# EAGLE design zx01io (EAGLE 4.08)
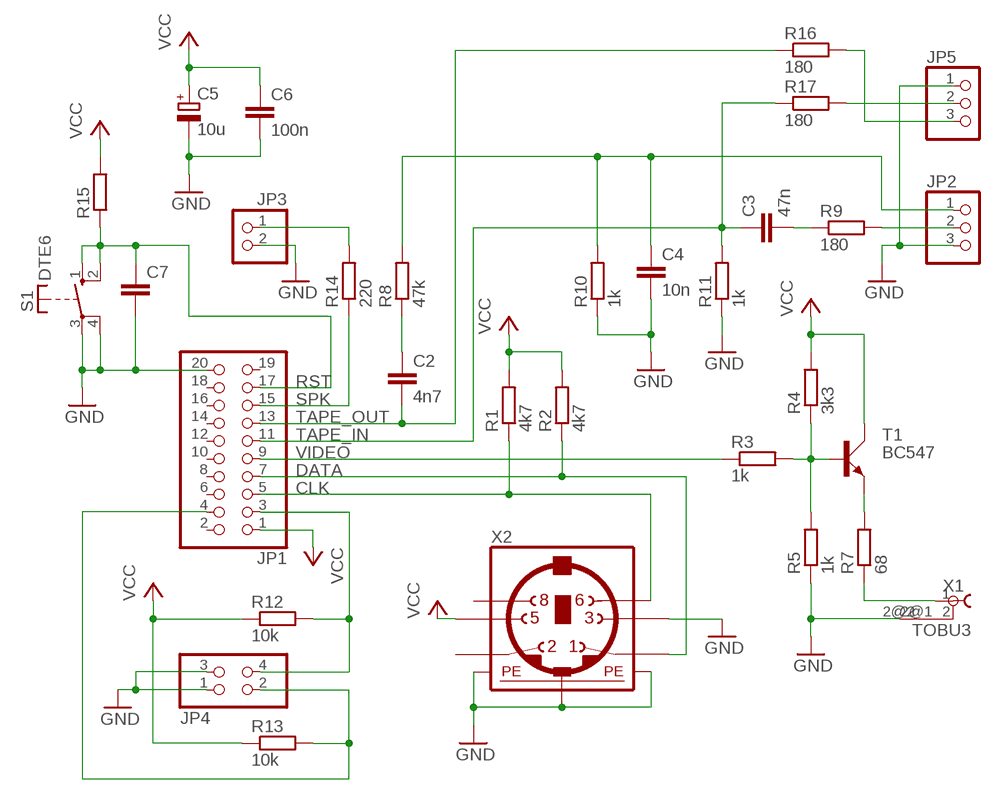
[diagram p0: schematic, sheet 1]

## Parts
C2  4n7  C-EU050-025X075  [C050-025X075]
C3  47n  C-EU050-025X075  [C050-025X075]
C4  10n  C-EU050-025X075  [C050-025X075]
C5  10u  CPOL-EUE5-6  [E5-6]
C6  100n  C-EU050-030X075  [C050-030X075]
C7  C-EU050-025X075  [C050-025X075]
JP1  PINHD-2X10  [2X10]
JP2  PINHD-1X3  [1X03]
JP3  PINHD-1X2  [1X02]
JP4  PINHD-2X2  [2X02]
JP5  PINHD-1X3  [1X03]
R1  4k7  R-EU_0207/5V  [0207/5V]
R2  4k7  R-EU_0207/5V  [0207/5V]
R3  1k  R-EU_0207/5V  [0207/5V]
R4  3k3  R-EU_0207/5V  [0207/5V]
R5  1k  R-EU_0207/5V  [0207/5V]
R7  68  R-EU_0207/5V  [0207/5V]
R8  47k  R-EU_0207/5V  [0207/5V]
R9  180  R-EU_0207/5V  [0207/5V]
R10  1k  R-EU_0207/5V  [0207/5V]
R11  1k  R-EU_0207/5V  [0207/5V]
R12  10k  R-EU_0207/5V  [0207/5V]
R13  10k  R-EU_0207/5V  [0207/5V]
R14  220  R-EU_0207/5V  [0207/5V]
R15  R-EU_0207/5V  [0207/5V]
R16  180  R-EU_0207/5V  [0207/5V]
R17  180  R-EU_0207/5V  [0207/5V]
S1  DTE6  [DTE6]
T1  BC547  [SOT54A]
X1  TOBU3  [TOBU3]
X2  MINI_DIN_6  [M_DIN6]

## Nets
CLK: JP1.5 R1.1 X2.6
DATA: JP1.7 R2.1 X2.1
GND: C4.2 C5.- C6.2 C7.2 JP1.20 JP2.3 JP3.2 JP4.1 JP4.3 JP5.1 R5.1 R10.1 R11.1 S1.3(P) S1.4(P) X1.2@2 X2.3 X2.SH1(PE1) X2.SH2(PE2) X2.SH3(PE3)
N$1: JP1.3 JP4.4 R12.2
N$2: JP1.4 JP4.2 R13.2
N$3: JP5.3 R16.2
N$4: R3.2 R4.1 R5.2 T1.B
N$5: JP5.2 R17.2
N$6: C2.1 R8.1
N$8: R7.2 T1.E
N$9: C3.2 R9.1
N$10: JP2.2 R9.2
N$11: C4.1 JP2.1 R8.2 R10.2
N$14: R7.1 X1.1
N$15: JP3.1 R14.2
RST: C7.1 JP1.17 R15.1 S1.1(S) S1.2(S)
SPK: JP1.15 R14.1
TAPE_IN: C3.1 JP1.11 R11.2 R17.1
TAPE_OUT: C2.2 JP1.13 R16.1
VCC: C5.+ C6.1 JP1.1 R1.2 R2.2 R4.2 R12.1 R13.1 R15.2 T1.C X2.5
VIDEO: JP1.9 R3.1
Unconnected: JP1.2 JP1.6 JP1.8 JP1.10 JP1.12 JP1.14 JP1.16 JP1.18 JP1.19 X1.2 X1.2@1 X2.2 X2.8

## Library data of the parts
C2-C4 C6 C7 = rcl:C-EU: CAPACITOR, European symbol
C5 = rcl:CPOL-EU: POLARIZED CAPACITOR, European symbol
JP1 = pinhead:PINHD-2X10: PIN HEADER
JP2 JP5 = pinhead:PINHD-1X3: PIN HEADER
JP3 = pinhead:PINHD-1X2: PIN HEADER
JP4 = pinhead:PINHD-2X2: PIN HEADER
R1-R5 R7-R17 = rcl:R-EU_: RESISTOR, European symbol
S1 = switch-misc:DT: ITT SWITCH
T1 = transistor-small-signal:BC547: NPN TRANSISTOR
X1 = con-hirschmann:TOBU3: Female Cinch CONNECTOR
X2 = mini_din:MINI_DIN_6

## Board
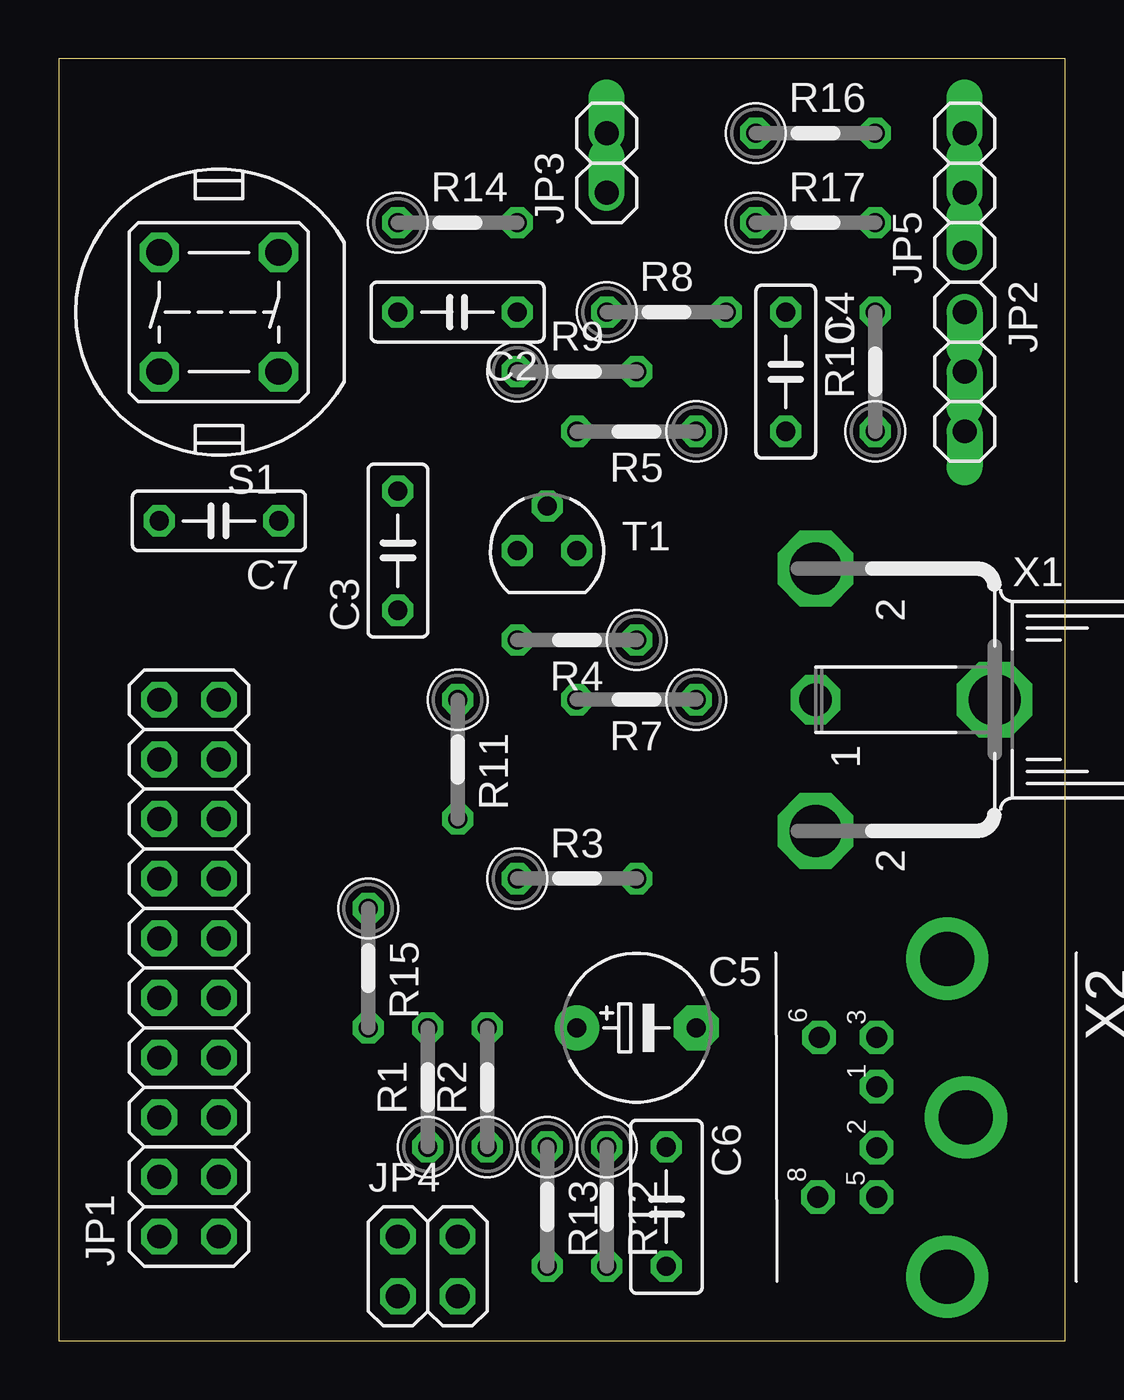
[diagram p1: board, top side]
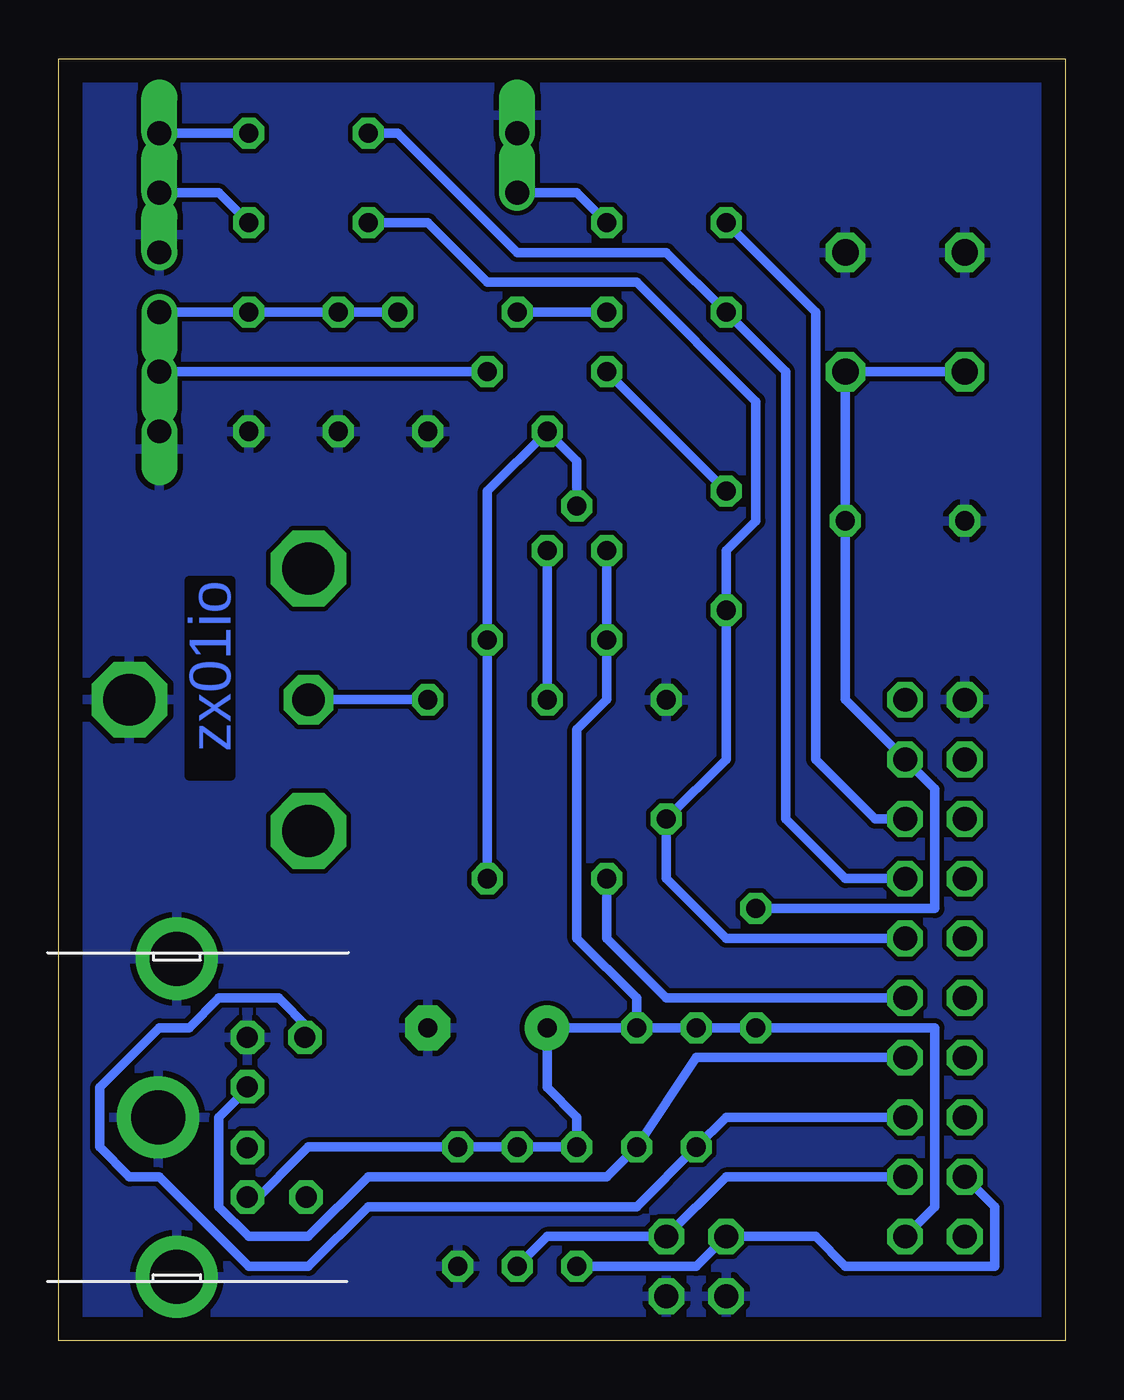
[diagram p2: board, bottom side, seen from below]

Size 42.85 x 54.6 mm. Coordinates in mm from the lower left corner, seen from the top.
Outline: 0,0 42.85,0 42.85,54.6 0,54.6 0,0
Copper layers used: Bottom

### Footprints (pad centres in the part's own frame; a part is rotated, then mirrored left to right if it is on the bottom)
C050-025X075 = drill 0.813 octagon: 1 -2.54,0; 2 2.54,0
E5-6 = drill 0.813 pad 1.905 round: + -2.54,0 | drill 0.813 pad 1.905 octagon: - 2.54,0
C050-030X075 = drill 0.813 octagon: 1 -2.54,0; 2 2.54,0
2X10 = drill 1.016 octagon: 1 -11.43,-1.27; 2 -11.43,1.27; 3 -8.89,-1.27; 4 -8.89,1.27; 5 -6.35,-1.27; 6 -6.35,1.27; 7 -3.81,-1.27; 8 -3.81,1.27; 9 -1.27,-1.27; 10 -1.27,1.27; 11 1.27,-1.27; 12 1.27,1.27; 13 3.81,-1.27; 14 3.81,1.27; 15 6.35,-1.27; 16 6.35,1.27; 17 8.89,-1.27; 18 8.89,1.27; 19 11.43,-1.27; 20 11.43,1.27
1X03 = drill 1.016 offset: 1 -2.54,0; 2 0,0; 3 2.54,0
1X02 = drill 1.016 offset: 1 -1.27,0; 2 1.27,0
2X02 = drill 1.016 octagon: 1 -1.27,-1.27; 2 -1.27,1.27; 3 1.27,-1.27; 4 1.27,1.27
0207/5V = drill 0.813 octagon: 1 -2.54,0; 2 2.54,0
DTE6 = drill 1.118 octagon: 1 -2.54,2.54; 2 2.54,2.54; 3 2.54,-2.54; 4 -2.54,-2.54
SOT54A = drill 0.813 octagon: B 0,1.905; C -1.27,0; E 1.27,0
TOBU3 = drill 1.397 octagon: 1 0,-2.54 | drill 2.21 octagon: 2 5.588,-2.54; 2@1 -5.588,-2.54; 2@2 0,5.08
M_DIN6 = drill 0.9 pad 1.422 octagon: 1 -1.3,-3.75; 2 1.3,-3.75; 3 -3.4,-3.75; 5 3.4,-3.75; 6 -3.4,-6.2; 8 3.4,-6.25 | drill 2.3 pad 3.5 round: SH1 6.8,-0.75; SH2 0,0.05; SH3 -6.75,-0.75

### Placement (x,y rotation side)
C2  16.98,43.81 180 top
C3  14.44,33.65 90 top
C4  30.95,41.27 270 top
C5  24.6,13.33 0 top
C6  25.87,5.71 270 top
C7  6.82,34.92 180 top
JP1  5.55,15.87 90 top
JP2  38.57,41.27 270 top
JP3  23.33,50.16 90 top
JP4  15.71,3.17 0 top
JP5  38.57,48.89 90 top
R1  15.71,10.79 90 top
R2  18.25,10.79 90 top
R3  22.06,19.68 0 top
R4  22.06,29.84 180 top
R5  24.6,38.73 180 top
R7  24.6,27.3 180 top
R8  25.87,43.81 0 top
R9  22.06,41.27 0 top
R10  34.76,41.27 90 top
R11  16.98,24.76 270 top
R12  23.33,5.71 270 top
R13  20.79,5.71 270 top
R14  16.98,47.62 0 top
R15  13.17,15.87 270 top
R16  32.22,51.43 0 top
R17  32.22,47.62 0 top
S1  6.82,43.81 180 top
T1  20.79,33.65 0 top
X1  34.76,27.3 270 top
X2  38.57,9.52 270 top

### Tracks (layer width: path | path; a pad name or v marks a point on that pad's centre or on a via)
CLK
  Bottom 0.406: JP1.5 14.44,9.52 R1.1 18.25,5.71 29.68,5.71 32.22,3.17 34.76,3.17 38.57,6.98 39.84,6.98 41.11,8.25 41.11,10.79 38.57,13.33 37.3,13.33 36.03,14.6 33.49,14.6 32.22,13.33 32.37,13.18 X2.6
DATA
  Bottom 0.406: JP1.7 15.71,12.06 R2.1 19.52,6.98 29.68,6.98 32.22,4.44 34.76,4.44 36.03,5.71 36.03,9.52 34.76,10.79 34.79,10.82 X2.1
GND
  pour Bottom: 0.47,53.97 0.47,0.63 42.38,0.63 42.38,53.97
N$1
  Bottom 0.406: R12.2 22.06,4.44 JP4.4 14.44,6.98 JP1.3
N$2
  Bottom 0.406: R13.2 15.71,3.17 JP4.2 10.63,4.44 9.36,3.17 3.01,3.17 3.01,5.71 JP1.4
N$3
  Bottom 0.406: R16.2 JP5.3
N$4
  Bottom 0.406: R3.2 R4.1 24.6,36.19 R5.2 20.79,37.46 T1.B
N$5
  Bottom 0.406: R17.2 36.03,48.89 JP5.2
N$6
  Bottom 0.406: C2.1 R8.1
N$8
  Bottom 0.406: R7.2 T1.E
N$9
  Bottom 0.406: C3.2 R9.1
N$10
  Bottom 0.406: R9.2 JP2.2
N$11
  Bottom 0.406: R8.2 C4.1 R10.2 JP2.1
N$14
  Bottom 0.406: R7.1 X1.1
N$15
  Bottom 0.406: R14.2 20.79,48.89 JP3.1
RST
  Bottom 0.406: S1.2 S1.1 C7.1 9.36,27.3 JP1.17 5.55,23.49 5.55,18.41 R15.1
SPK
  Bottom 0.406: JP1.15 8.09,22.22 10.63,24.76 10.63,43.81 R14.1
TAPE_IN
  Bottom 0.406: JP1.11 14.44,17.14 16.98,19.68 R11.2 14.44,24.76 C3.1 14.44,33.65 13.17,34.92 13.17,40 18.25,45.08 24.6,45.08 27.14,47.62 R17.1
TAPE_OUT
  Bottom 0.406: JP1.13 9.36,19.68 11.9,22.22 11.9,41.27 C2.2 16.98,46.35 23.33,46.35 28.41,51.43 R16.1
VCC
  Bottom 0.406: R2.2 R1.2 R15.2 5.55,13.33 5.55,5.71 JP1.1 | R2.2 C5.+ 22.06,10.79 20.79,9.52 R13.1 R12.1 C6.1 32.22,8.25 34.76,5.71 34.82,5.77 X2.5 | R2.2 18.25,14.6 20.79,17.14 20.79,26.03 19.52,27.3 R4.2 T1.C
VIDEO
  Bottom 0.406: R3.1 19.52,17.14 16.98,14.6 JP1.9

### Text on the board
Bottom: zx01io